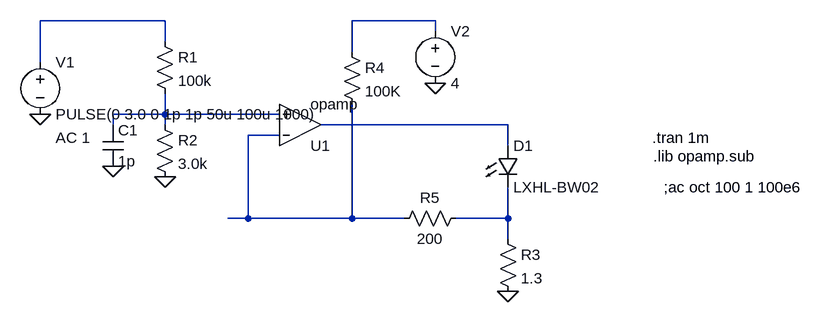
[diagram p0: schematic simple LED driver.  Duh.asc]
simple LED driver.  Duh.asc, the LTspice schematic file:
Version 4
SHEET 1 1216 680
WIRE 208 -192 16 -192
WIRE 624 -192 496 -192
WIRE 624 -176 624 -192
WIRE 208 -160 208 -192
WIRE 496 -144 496 -192
WIRE 16 -128 16 -192
WIRE 208 -48 208 -80
WIRE 208 -48 128 -48
WIRE 384 -48 208 -48
WIRE 128 -32 128 -48
WIRE 208 -32 208 -48
WIRE 736 -32 448 -32
WIRE 384 -16 336 -16
WIRE 736 0 736 -32
WIRE 336 112 336 -16
WIRE 336 112 304 112
WIRE 496 112 496 -64
WIRE 496 112 336 112
WIRE 576 112 496 112
WIRE 736 112 736 64
WIRE 736 112 656 112
WIRE 736 144 736 112
FLAG 736 224 0
FLAG 208 48 0
FLAG 16 -48 0
FLAG 128 32 0
FLAG 624 -96 0
SYMBOL res 192 -176 R0
SYMATTR InstName R1
SYMATTR Value 100k
SYMBOL res 192 -48 R0
SYMATTR InstName R2
SYMATTR Value 3.0k
SYMBOL res 720 128 R0
SYMATTR InstName R3
SYMATTR Value 1.3
SYMBOL LED 720 0 R0
SYMATTR InstName D1
SYMATTR Value LXHL-BW02
SYMATTR Description Diode
SYMATTR Type diode
SYMBOL Opamps\\opamp 416 32 M180
SYMATTR InstName U1
SYMBOL voltage 16 -144 R0
WINDOW 123 24 132 Left 0
WINDOW 39 0 0 Left 0
SYMATTR InstName V1
SYMATTR Value PULSE(0 3.0 0 1p 1p 50u 100u 1000)
SYMATTR Value2 AC 1
SYMBOL res 672 96 R90
WINDOW 0 0 56 VBottom 0
WINDOW 3 32 56 VTop 0
SYMATTR InstName R5
SYMATTR Value 200
SYMBOL cap 112 -32 R0
SYMATTR InstName C1
SYMATTR Value 1p
SYMBOL res 480 -160 R0
SYMATTR InstName R4
SYMATTR Value 100K
SYMBOL voltage 624 -192 R0
WINDOW 123 24 132 Left 0
WINDOW 39 0 0 Left 0
SYMATTR InstName V2
SYMATTR Value 4
TEXT 960 16 Left 0 !.lib opamp.sub
TEXT 958 -12 Left 0 !.tran 1m
TEXT 976 64 Left 0 !;ac oct 100 1 100e6

The netlist it stands for:
* simple LED driver.  Duh.asc
R1 N001 N003 100k
R2 N003 0 3.0k
R3 N006 0 1.3
D1 N004 N006 LXHL-BW02
XU1 N005 N003 N004 opamp Aol=100K GBW=10Meg  ; pins invin noninvin out
V1 N001 0 PULSE(0 3.0 0 1p 1p 50u 100u 1000) AC 1
R5 N006 N005 200
C1 N003 0 1p
R4 N002 N005 100K
V2 N002 0 4
.model D D
.lib standard.dio
.lib opamp.sub
.tran 1m
;ac oct 100 1 100e6
.backanno
.end